# EAGLE schematic Communication_Plug_USB_Mini_B_Wurth_651305142821 (EAGLE 6.5.0)
USB Mini B Receptacle Wurth 651305142821 mini USB AB <http://katalog.we-online.de/em/datasheet/651305142821.pdf> Surface Mount As per USB spec, the capacitance across the USB power lines must be between 1µf and 10µf. Use 5V_USB service and a load limiter like the FPF2123 if your board does not meet this specification or if you are unsure.
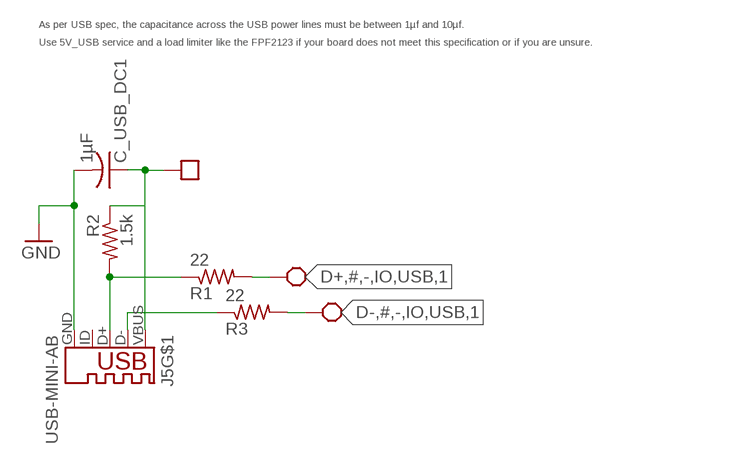
[diagram p0: schematic, sheet 1]

## Parts
C_USB_DC1  1µF  C-USC0603  [C0603]
J5  USB-MINI-AB  USB-BUSB-MINI-AB-SMT  [USB-MINI-AB-SMT]
R1  22  R-US_R0603  [R0603]
R2  1.5k  R-US_R0603  [R0603]
R3  22  R-US_R0603  [R0603]

## Nets
5V,#,+,O/5V_USB,#,+,O: C_USB_DC1.1 J5.VBUS(1_VBUS) R2.1 ; supply symbol labelled BLOCK_OPTIONAL
D+,#,-,IO,USB,1: R1.2 ; supply symbol labelled BLOCK_REQUIREMENT
D+_IN_1: J5.D+(3_D+) R1.1 R2.2
D-,#,-,IO,USB,1: R3.2 ; supply symbol labelled BLOCK_REQUIREMENT
D-_IN_1: J5.D-(2_D-) R3.1
GND: C_USB_DC1.2 J5.GND(5_GND)
Unconnected: J5.ID(4_ID) J5.P1(S) J5.P2(S) J5.P3(S) J5.P4(S)

## Notes on the sheet
- As per USB spec, the capacitance across the USB power lines must be between 1µf and 10µf.
- Use 5V_USB service and a load limiter like the FPF2123 if your board does not meet this specification or if you are unsure.

## Library data of the parts
C_USB_DC1 = resistor:C-US: CAPACITOR, American symbol
J5 = qualified_1:USB-B; DM: 0; DR: 180.000; DX: 63.000; DY: 32.200; PARTNO: 651305142821; SHEETNO: 2
R1-R3 = resistor:R-US_: RESISTOR, American symbol

## Net classes
4 xxwide: width 0.203 mm